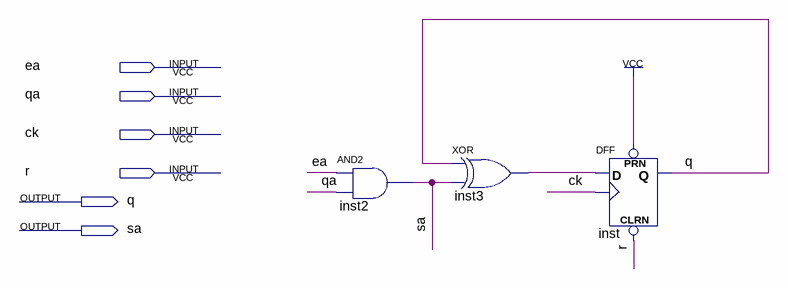
[diagram p0: schematic sheet]
// Quartus schematic bfs_barreira_ff.bdf as structural Verilog: 3 symbols, 6 pins
module bfs_barreira_ff (
  input  ea,
  input  qa,
  input  ck,
  input  r,
  output q,
  output sa
);

  wire inst3_out;

  and inst2 (sa, ea, qa);
  xor inst3 (inst3_out, q, sa);
  DFF inst (.CLRN(r), .CLK(ck), .D(inst3_out), .PRN(1'b1), .Q(q));
endmodule
